# EAGLE design Full Thermocouple (EAGLE 9.5.0)
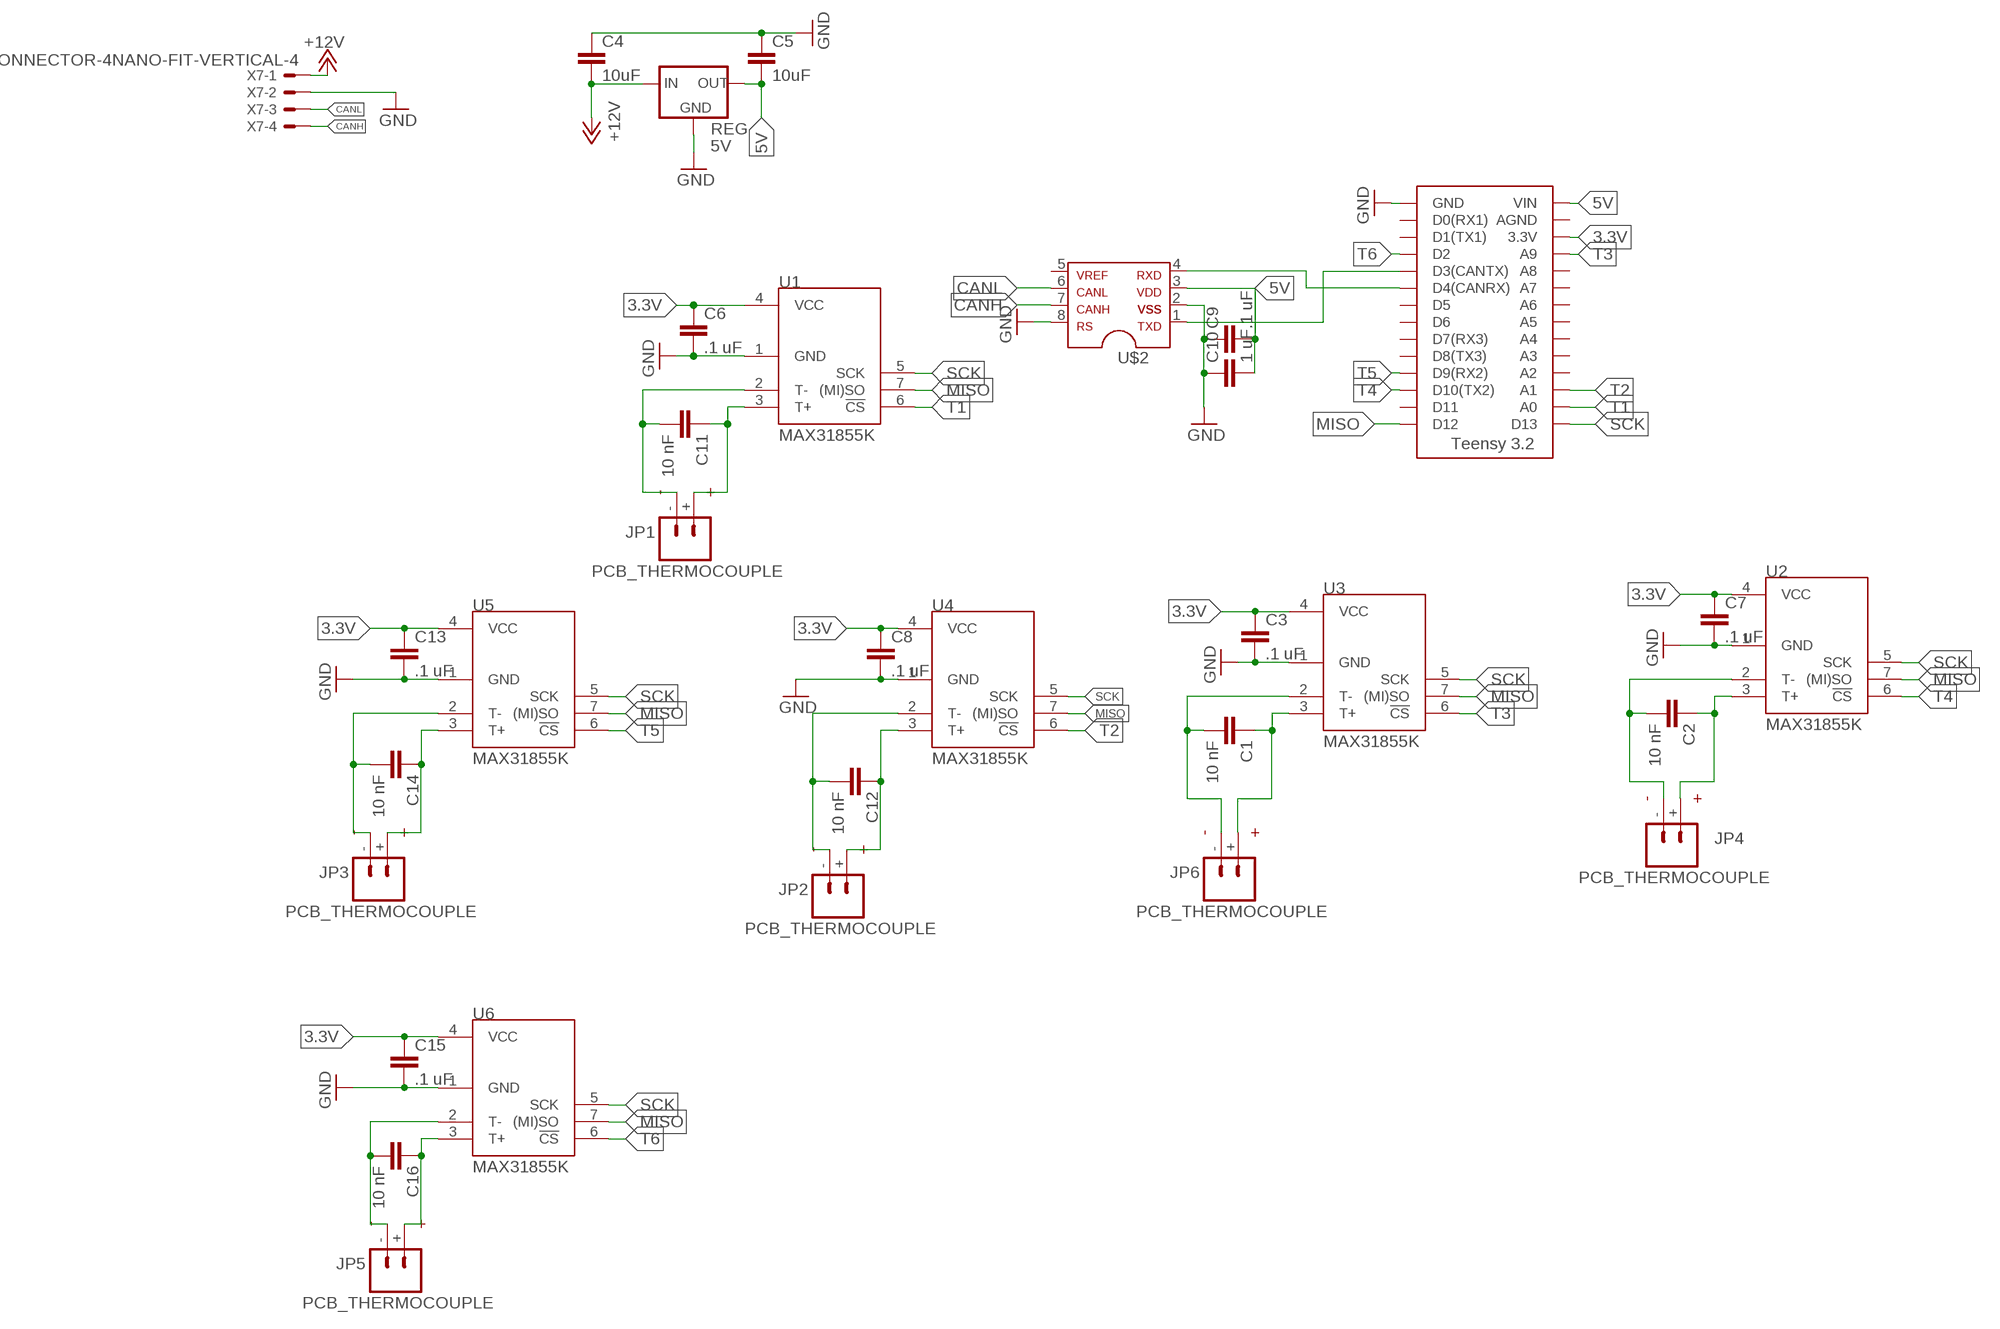
[diagram p0: schematic, sheet 1]

## Parts
C1  10 nF  CAP0805  [0805]
C2  10 nF  CAP0805  [0805]
C3  .1 uF  CAP0805  [0805]
C4  10uF  CAP0805  [0805]
C5  10uF  CAP0805  [0805]
C6  .1 uF  CAP0805  [0805]
C7  .1 uF  CAP0805  [0805]
C8  .1 uF  CAP0805  [0805]
C9  .1 uF  CAP0805  [0805]
C10  1 uF  CAP0805  [0805]
C11  10 nF  CAP0805  [0805]
C12  10 nF  CAP0805  [0805]
C13  .1 uF  CAP0805  [0805]
C14  10 nF  CAP0805  [0805]
C15  .1 uF  CAP0805  [0805]
C16  10 nF  CAP0805  [0805]
JP1  PCB_THERMOCOUPLE  [PCC-SMP]
JP2  PCB_THERMOCOUPLE  [PCC-SMP]
JP3  PCB_THERMOCOUPLE  [PCC-SMP]
JP4  PCB_THERMOCOUPLE  [PCC-SMP]
JP5  PCB_THERMOCOUPLE  [PCC-SMP]
JP6  PCB_THERMOCOUPLE  [PCC-SMP]
REG  5V  OKI-78SR-5  [OKI-78SR]
U1  MAX31855K  [SOIC8]
U2  MAX31855K  [SOIC8]
U3  MAX31855K  [SOIC8]
U4  MAX31855K  [SOIC8]
U5  MAX31855K  [SOIC8]
U6  MAX31855K  [SOIC8]
U$1  TEENSY_3.2_SIMPLE  [TEENSY_3.2_SIMPLE]
U$2  MCP2551  [SOIC-08]
X7  CONNECTOR-4NANO-FIT-VERTICAL-4  [NANO-FIT_VERTICAL-4]

## Nets
3.3V: C3.1 C6.1 C7.1 C8.1 C13.1 C15.1 U1.4(VCC) U2.4(VCC) U3.4(VCC) U4.4(VCC) U5.4(VCC) U6.4(VCC) U$1.3.3V
5V: C5.2 C9.2 C10.2 REG.3(OUT) U$1.VIN U$2.3
+12V: C4.2 REG.1(IN) X7.P$1
CANH: U$2.7 X7.P$4
CANL: U$2.6 X7.P$3
GND: C3.2 C4.1 C5.1 C6.2 C7.2 C8.2 C9.1 C10.1 C13.2 C15.2 REG.2(GND) U1.1(GND) U2.1(GND) U3.1(GND) U4.1(GND) U5.1(GND) U6.1(GND) U$1.GND U$2.2 U$2.8 X7.P$2
MISO: U1.7((MI)SO) U2.7((MI)SO) U3.7((MI)SO) U4.7((MI)SO) U5.7((MI)SO) U6.7((MI)SO) U$1.D12
N$1: U$1.D3(CANTX) U$2.1
N$2: C16.1 JP5.+ U6.3(T+)
N$3: C11.2 JP1.- U1.2(T-)
N$4: C16.2 JP5.- U6.2(T-)
N$5: C12.1 JP2.+ U4.3(T+)
N$6: C2.1 JP4.+ U2.3(T+)
N$7: C11.1 JP1.+ U1.3(T+)
N$9: C12.2 JP2.- U4.2(T-)
N$12: C2.2 JP4.- U2.2(T-)
N$13: U$1.D4(CANRX) U$2.4
N$15: C1.1 JP6.+ U3.3(T+)
N$19: C1.2 JP6.- U3.2(T-)
N$21: C14.1 JP3.+ U5.3(T+)
N$22: C14.2 JP3.- U5.2(T-)
SCK: U1.5(SCK) U2.5(SCK) U3.5(SCK) U4.5(SCK) U5.5(SCK) U6.5(SCK) U$1.D13
T1: U1.6(!CS) U$1.A0
T2: U4.6(!CS) U$1.A1
T3: U3.6(!CS) U$1.A9
T4: U2.6(!CS) U$1.D10(TX2)
T5: U5.6(!CS) U$1.D9(RX2)
T6: U6.6(!CS) U$1.D2
Unconnected: JP1.CLIP1 JP1.CLIP2 JP2.CLIP1 JP2.CLIP2 JP3.CLIP1 JP3.CLIP2 JP4.CLIP1 JP4.CLIP2 JP5.CLIP1 JP5.CLIP2 JP6.CLIP1 JP6.CLIP2 U$1.A2 U$1.A3 U$1.A4 U$1.A5 U$1.A6 U$1.A7 U$1.A8 U$1.AGND U$1.D0(RX1) U$1.D1(TX1) U$1.D5 U$1.D6 U$1.D7(RX3) U$1.D8(TX3) U$1.D11 U$2.5

## Library data of the parts
C1-C16 = HyTechDevices:CAP: Capacitor Standard 0603 ceramic capacitor, and 0.1" leaded capacitor.
JP1-JP6 = Testing:PCB_THERMOCOUPLE: Circuit Board Thermocouple Connectors Glass-Filled Nylon 220°C (425°F) The PCC connector from OMEGA is perfect for bringing thermocouple probes to printed circuit boards. (OMEGA PCC-SMP) For type-k thermocouples.
REG = HyTechDevices:OKI-78SR-5: Murata OKI-78SR 5V 1.5A Non-Isolated Switching Regulator DC/DC - Datasheet <https://power.murata.com/data/power/oki-78sr.pdf>
U1-U6 = SparkFun-AnalogIC:MAX31855K: Cold-Junction-Compensated K-Thermocoupleto-Digital Converter (-270°C to +1800°C) The MAX31855K performs cold-junction compensation and digitizes the signal from a type-K thermocouple. The data is output in a 14-bit resolution, SPI™-compatible, read-only format. This converter resolves temperatures to 0.25°C, allows readings as high as +1800°C and as low as -270°C, and exhibits thermocouple accuracy of ±2°C for temperatures ranging from -200°C to +700°C for K-type thermocouples.; PROD_ID: IC-12578
U$1 = HyTechDevices:TEENSY_3.2_SIMPLE: Simple version of the Teensy 3.2 board that only uses the 2 main rows of pins, not the inner pins or the pins opposite the usb port.
U$2 = HyTechDevices:MCP2551: MCP2551 High-Speed CAN Transceiver Product Webpage <https://www.microchip.com/wwwproducts/en/MCP2551> Datasheet <http://ww1.microchip.com/downloads/en/DeviceDoc/21667f.pdf> This device is outdated It is replaced by MCP2561. Comparison Page <https://www.microchip.com/wwwproducts/ProductCompare/MCP2551/MCP2561> Product Webpage <https://www.microchip.com/wwwproducts/en/MCP2561> Datasheet <http://ww1.microchip.com/downloads/en/DeviceDoc/20005167C.pdf>
X7 = HyTechDevices:CONNECTOR-4: Mini-Fit Junior connector 4 pole Source: http://www.molex.com

## Board
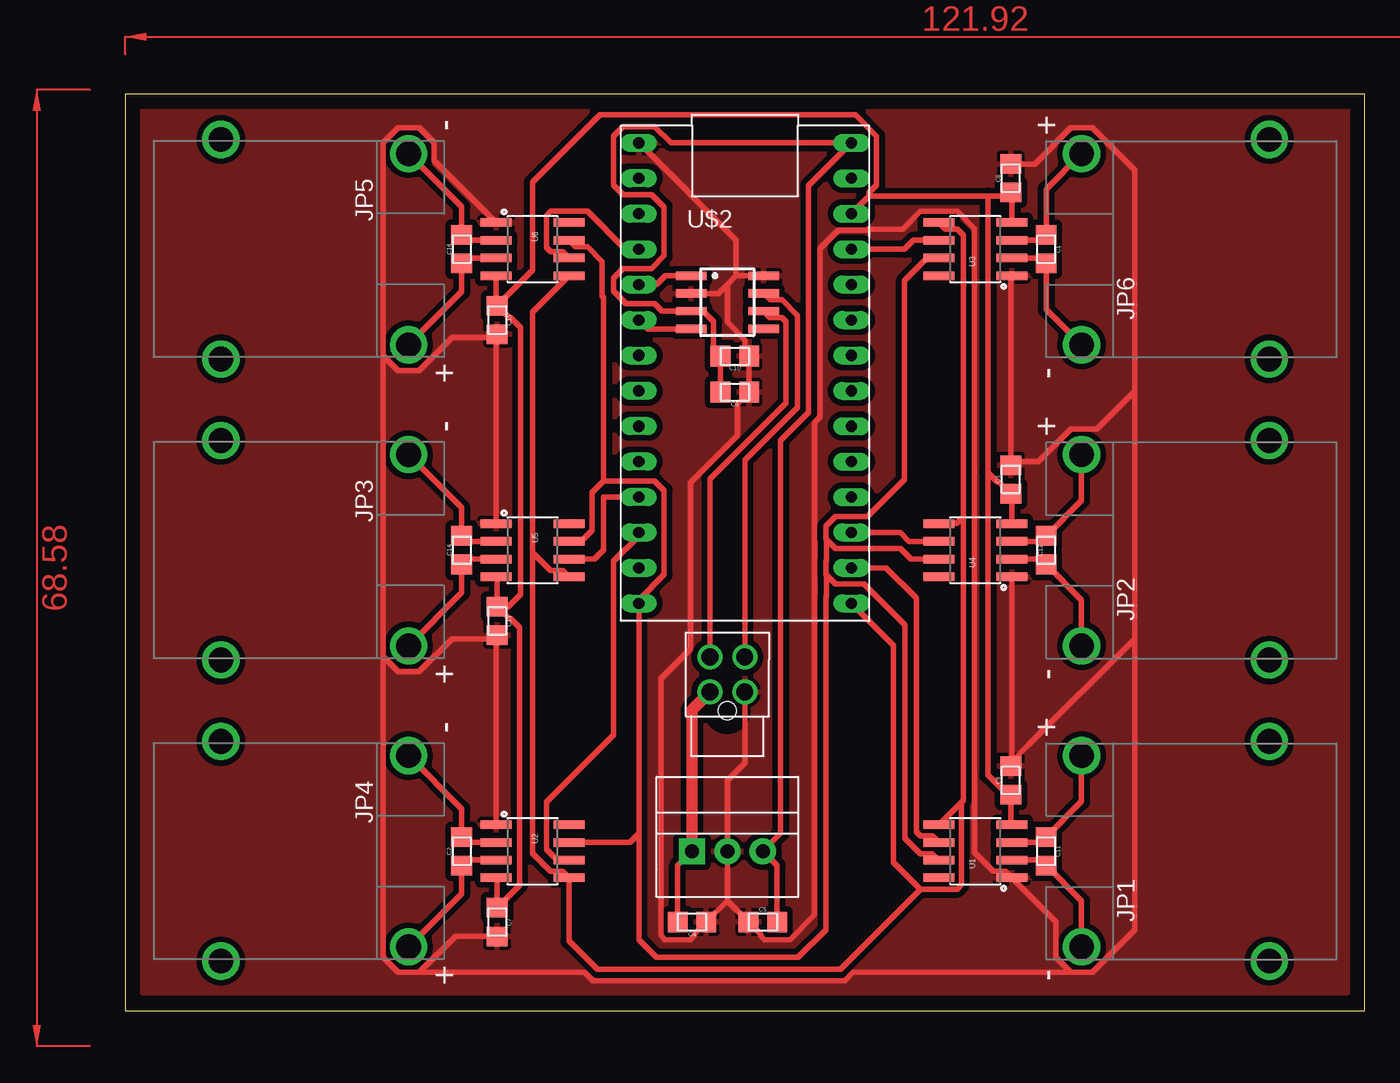
[diagram p1: board, top side]

Size 88.88 x 65.71 mm. Coordinates in mm from the lower left corner, seen from the top.
Outline: 0,0 88.88,0 88.88,65.71 0,65.71 0,0
Copper layers (1*16): Top 0.035mm / dielectric 1.5mm / Bottom 0.035mm
Design rules "DRC InventionStudio": minimum track width 16mil, minimum drill 0.8mm, track to track 16mil, track to pad 12mil, pad to pad 16mil, via to via 16mil, smd to smd 10mil, copper to edge 40mil, drill to drill 10mil, minimum pad ring 10mil, minimum via ring 8mil, stop-mask expansion 4mil, vias tented up to drill 0mil, thermal gap 10mil

### Footprints (pad centres in the part's own frame; a part is rotated, then mirrored left to right if it is on the bottom)
0805 = smd 1.4 x 1.5: 1 -1.025,0; 2 1.025,0
PCC-SMP = drill 1.778: + 6.858,0; - -6.858,0; CLIP1 -7.874,-13.462; CLIP2 7.874,-13.462
OKI-78SR = drill 1 pad 1.88 square: 1 -2.54,0 | drill 1 pad 1.88: 2 0,0; 3 2.54,0
SOIC8 = smd 0.61 x 2.21: 1 -1.905,-2.616; 2 -0.635,-2.616; 3 0.635,-2.616; 4 1.905,-2.616; 5 1.905,2.616; 6 0.635,2.616; 7 -0.635,2.616; 8 -1.905,2.616
TEENSY_3.2_SIMPLE = drill 0.8 long: 3.3V 16.51,29.21; A0 16.51,3.81; A1 16.51,6.35; A2 16.51,8.89; A3 16.51,11.43; A4 16.51,13.97; A5 16.51,16.51; A6 16.51,19.05; A7 16.51,21.59; A8 16.51,24.13; A9 16.51,26.67; AGND 16.51,31.75; D0(RX1) 1.27,31.75; D1(TX1) 1.27,29.21; D2 1.27,26.67; D3(CANTX) 1.27,24.13; D4(CANRX) 1.27,21.59; D5 1.27,19.05; D6 1.27,16.51; D7(RX3) 1.27,13.97; D8(TX3) 1.27,11.43; D9(RX2) 1.27,8.89; D10(TX2) 1.27,6.35; D11 1.27,3.81; D12 1.27,1.27; D13 16.51,1.27; GND 1.27,34.29; VIN 16.51,34.29
SOIC-08 = smd 0.6 x 2.2: 1 -1.905,-2.6; 2 -0.635,-2.6; 3 0.635,-2.6; 4 1.905,-2.6; 5 1.905,2.6; 6 0.635,2.6; 7 -0.635,2.6; 8 -1.905,2.6
NANO-FIT_VERTICAL-4 = drill 1.2: P$1 -1.25,0; P$2 1.25,0; P$3 -1.25,2.5; P$4 1.25,2.5 | hole 1.3: 0,-1.34

### Placement (x,y rotation side)
C1  66.04,54.61 270 top
C2  24.13,11.43 90 top
C3  63.5,38.1 90 top
C4  40.64,6.35 180 top
C5  45.72,6.35 0 top
C6  63.5,16.51 90 top
C7  26.67,6.35 270 top
C8  63.5,59.69 90 top
C9  43.71,44.35 180 top
C10  43.71,46.94 180 top
C11  66.04,11.43 270 top
C12  66.04,33.02 270 top
C13  26.67,27.94 270 top
C14  24.13,33.02 90 top
C15  26.67,49.53 270 top
C16  24.13,54.61 90 top
JP1  68.58,11.43 90 top
JP2  68.58,33.02 90 top
JP3  20.32,33.02 270 top
JP4  20.32,11.43 270 top
JP5  20.32,54.61 270 top
JP6  68.58,54.61 90 top
REG  43.18,11.43 0 top
U1  60.96,11.43 90 top
U2  29.21,11.43 270 top
U3  60.96,54.61 90 top
U4  60.96,33.02 90 top
U5  29.21,33.02 270 top
U6  29.21,54.61 270 top
U$1  35.56,27.94 0 top
U$2  43.18,50.8 270 top
X7  43.18,22.86 0 top

### Tracks (layer width: path | path; a pad name or v marks a point on that pad's centre or on a via)
3.3V
  Top 0.406: C15.1 26.59,50.63 U6.4 | C8.1 63.58,58.59 63.58,58.42 | 63.58,58.42 U3.4 | U4.4 63.58,37 C3.1 62.66,37.92 62.54,37.92 61.85,38.61 | U1.4 63.5,13.41 63.5,15.24 | 63.5,15.24 C6.1 | U5.4 26.67,31.04 C13.1 | U2.4 26.67,9.45 C7.1 28.27,8.98 28.27,27.48 27.63,28.12 27.51,28.12 C13.1 | U$1.3.3V 53.34,58.42 | 53.34,58.42 61.85,58.42 | 61.85,58.42 63.58,58.42 | 61.85,58.42 61.85,38.61 | 61.85,38.61 61.85,16.89 63.5,15.24 | C15.1 29.21,53.1 29.21,59.41 34.04,64.24 52.36,64.24 53.89,62.71 53.89,59.21 53.34,58.66 53.34,58.42 | C15.1 27.51,49.71 27.63,49.71 28.35,49 28.35,29.85 27.47,28.97 C13.1
5V
  Top 0.406: C9.2 C10.2 42.19,47.44 42.19,49.4 41.43,50.16 U$2.3 38.49,50.16 37.97,50.69 35.91,50.69 35.01,51.59 35.01,52.55 35.7,53.23 37.75,53.23 38.65,54.13 38.65,57.63 37.75,58.53 35.7,58.53 35.01,59.21 35.01,62.71 35.7,63.39 37.97,63.39 39.13,62.23 U$1.VIN 49.01,59.17 49.01,42.9 46.99,40.88 46.99,12.7 REG.3 46.74,10.41 C5.2
+12V
  Top 0.406: C4.2 39.62,10.41 REG.1
  Top 0.813: X7.P$1 40.64,21.57 REG.1
CANH
  Top 0.406: X7.P$4 44.43,39.47 48.2,43.24 48.2,49.86 47.09,50.98 46.24,50.98 U$2.7
CANL
  Top 0.406: U$2.6 46.24,49.7 47.09,49.7 47.39,49.4 47.39,43.58 41.93,38.12 X7.P$3
GND
  Top 0.406: U$2.8 43.81,52.71 | U$2.2 42.55,51.43 43.18,52.07 | 43.81,52.71 43.18,52.07 | U$1.GND 43.81,55.24 43.81,52.71 | 43.18,52.07 43.18,49.38 44.45,48.11 44.45,47.23 C10.1 C9.1 43.9,43.51 43.9,41.24 40.52,37.86 40.52,25.94 38.41,23.83 38.41,5.39 38.7,5.09 40.52,5.09 40.82,5.39 40.82,5.51 C4.1 43.18,7.87 | 43.18,7.87 REG.2 43.18,16.51 44.43,17.76 X7.P$2 | 43.18,7.87 C5.1 45.54,5.51 45.54,5.39 45.84,5.09 47.66,5.09 49.44,6.88 49.44,42.18 49.83,42.57 49.83,54.66 51.15,55.99 53.2,55.99 53.27,56.06 55.76,56.06 57.03,57.33 59.66,57.33 60.91,56.08 60.91,11.33 62.26,9.98 63.12,9.98 U1.1 66.74,6.36 66.74,3.81 67.82,2.73 | C3.2 63.5,39.37 | 63.5,39.37 63.5,52.63 U3.1 | U4.1 63.58,17.78 63.5,17.7 C6.2 63.5,17.78 64.77,19.05 72.39,26.67 | U2.1 26.59,26.67 | 26.59,26.67 26.59,26.84 C13.2 | U5.1 26.59,48.26 | 26.59,48.26 26.59,48.43 C15.2 | C8.2 65.22,60.71 67.82,63.31 69.34,63.31 72.39,60.26 72.39,44.45 | 72.39,44.45 69.66,41.72 67.82,41.72 65.47,39.37 63.5,39.37 | 72.39,44.45 72.39,26.67 | 67.82,2.73 69.34,2.73 72.39,5.78 72.39,26.67 | 18.48,46.99 19.56,45.91 21.08,45.91 23.43,48.26 26.59,48.26 | 18.48,46.99 18.48,62.23 19.56,63.31 21.08,63.31 22.16,62.23 22.16,60.95 U6.1 | 18.48,25.4 19.56,24.32 21.08,24.32 23.43,26.67 26.59,26.67 | 18.48,46.99 18.48,25.4 | 21.08,2.73 19.56,2.73 18.48,3.81 18.48,25.4 | C7.2 23.68,5.33 21.08,2.73 | 21.08,2.73 32.95,2.73 33.53,2.15 51.61,2.15 52.2,2.73 67.82,2.73
  pour Top: 1.27,64.77 1.27,1.27 87.63,1.27 87.63,64.77
MISO
  Top 0.406: U4.7 56.33,32.38 55.59,33.13 50.94,33.13 50.29,33.78 | 50.29,33.78 50.25,33.81 50.25,34.77 50.94,35.45 53.23,35.45 55.88,38.1 55.88,52.37 57.49,53.98 U3.7 | U1.7 57.89,11.25 57.03,11.25 55.92,12.36 55.92,27.66 52.99,30.59 50.94,30.59 50.29,31.24 | 50.29,31.24 50.25,31.27 50.25,32.23 50.29,32.26 50.29,33.78 | 50.29,31.24 50.29,29.72 50.25,29.69 50.25,5.8 48.26,3.81 38.1,3.81 36.83,5.08 36.83,12.7 | 36.83,12.7 U$1.D12 36.83,29.45 38.65,31.27 38.65,37.31 37.97,37.99 34.3,37.99 | U2.7 36.2,12.06 36.83,12.7 | 34.3,37.99 33.48,37.17 33.48,34.45 32.68,33.65 U5.7 | U6.7 32.28,54.79 33.14,54.79 34.2,53.73 34.2,51.25 34.3,51.15 34.3,37.99
N$1
  Top 0.406: U$1.D3(CANTX) 38.1,52.07 38.73,52.71 U$2.1
N$2
  Top 0.406: U6.3 24.52,53.98 C16.1 24.13,51.56 JP5.+
N$3
  Top 0.406: U1.2 65.65,10.8 C11.2 68.58,7.87 JP1.-
N$4
  Top 0.406: C16.2 24.13,55.88 | 24.13,55.88 24.13,57.66 JP5.- | U6.2 24.77,55.24 24.13,55.88
N$5
  Top 0.406: JP2.+ 68.58,36.59 C12.1 65.65,33.65 U4.3
N$6
  Top 0.406: JP4.+ 24.13,8.38 C2.1 24.52,10.8 U2.3
N$7
  Top 0.406: U1.3 65.65,12.06 C11.1 68.58,14.99 JP1.+
N$9
  Top 0.406: U4.2 65.65,32.38 C12.2 68.58,29.45 JP2.-
N$12
  Top 0.406: JP4.- 24.13,14.48 C2.2 24.52,12.06 U2.2
N$13
  Top 0.406: U$2.4 37.47,48.9 U$1.D4(CANRX)
N$15
  Top 0.406: U3.3 65.65,55.24 C1.1 66.04,58.93 JP6.+
N$19
  Top 0.406: JP6.- 66.04,50.29 C1.2 65.65,53.98 U3.2
N$21
  Top 0.406: U5.3 24.52,32.38 C14.1 24.13,29.97 JP3.+
N$22
  Top 0.406: JP3.- 24.13,36.07 C14.2 24.52,33.65 U5.2
SCK
  Top 0.406: U3.5 58.8,56.06 59.66,56.06 60.1,55.62 60.1,35.43 | 60.1,35.43 59.59,34.93 U4.5 | 60.1,35.43 60.1,15.09 59.96,14.95 | 59.96,14.95 U1.5 | U$1.D13 55.1,26.18 55.1,10.63 57.03,8.71 | 57.03,8.71 59.66,8.71 59.96,9.01 59.96,14.95 | 57.03,8.71 51.27,2.96 33.87,2.96 31.83,5 U2.5 31.37,9.98 30.51,9.98 29.21,11.28 29.21,32.87 | U6.5 29.21,50.09 29.21,32.87 | U5.5 31.37,31.57 30.51,31.57 29.21,32.87
T1
  Top 0.406: U1.6 57.89,12.52 57.03,12.52 56.73,12.82 56.73,29.58 54.56,31.75 U$1.A0
T2
  Top 0.406: U4.6 56.21,33.65 55.58,34.29 U$1.A1
T3
  Top 0.406: U3.6 56.52,55.24 55.88,54.61 U$1.A9
T4
  Top 0.406: U$1.D10(TX2) 36.83,34.05 35.01,32.23 35.01,19.77 30.21,14.97 30.21,11.55 30.97,10.8 U2.6
T5
  Top 0.406: U5.6 33.66,32.38 34.29,33.02 34.29,36.83 U$1.D9(RX2)
T6
  Top 0.406: U6.6 31.37,54.43 30.51,54.43 30.21,54.73 30.21,57.03 30.51,57.33 33.14,57.33 35.86,54.61 U$1.D2
(copper drawn outside any net)
  shapes: Top area x2